# EasyEDA schematic SCH_T-Info Rail DIN_2022-03-13.json
TITLE: T-InfoDIN - Module Télé-Information en boitier DIN; REV: 1.4; Date: 2021-05-20; Sheet: 1/1; Drawn By: TrimVa; Company: Tech4You
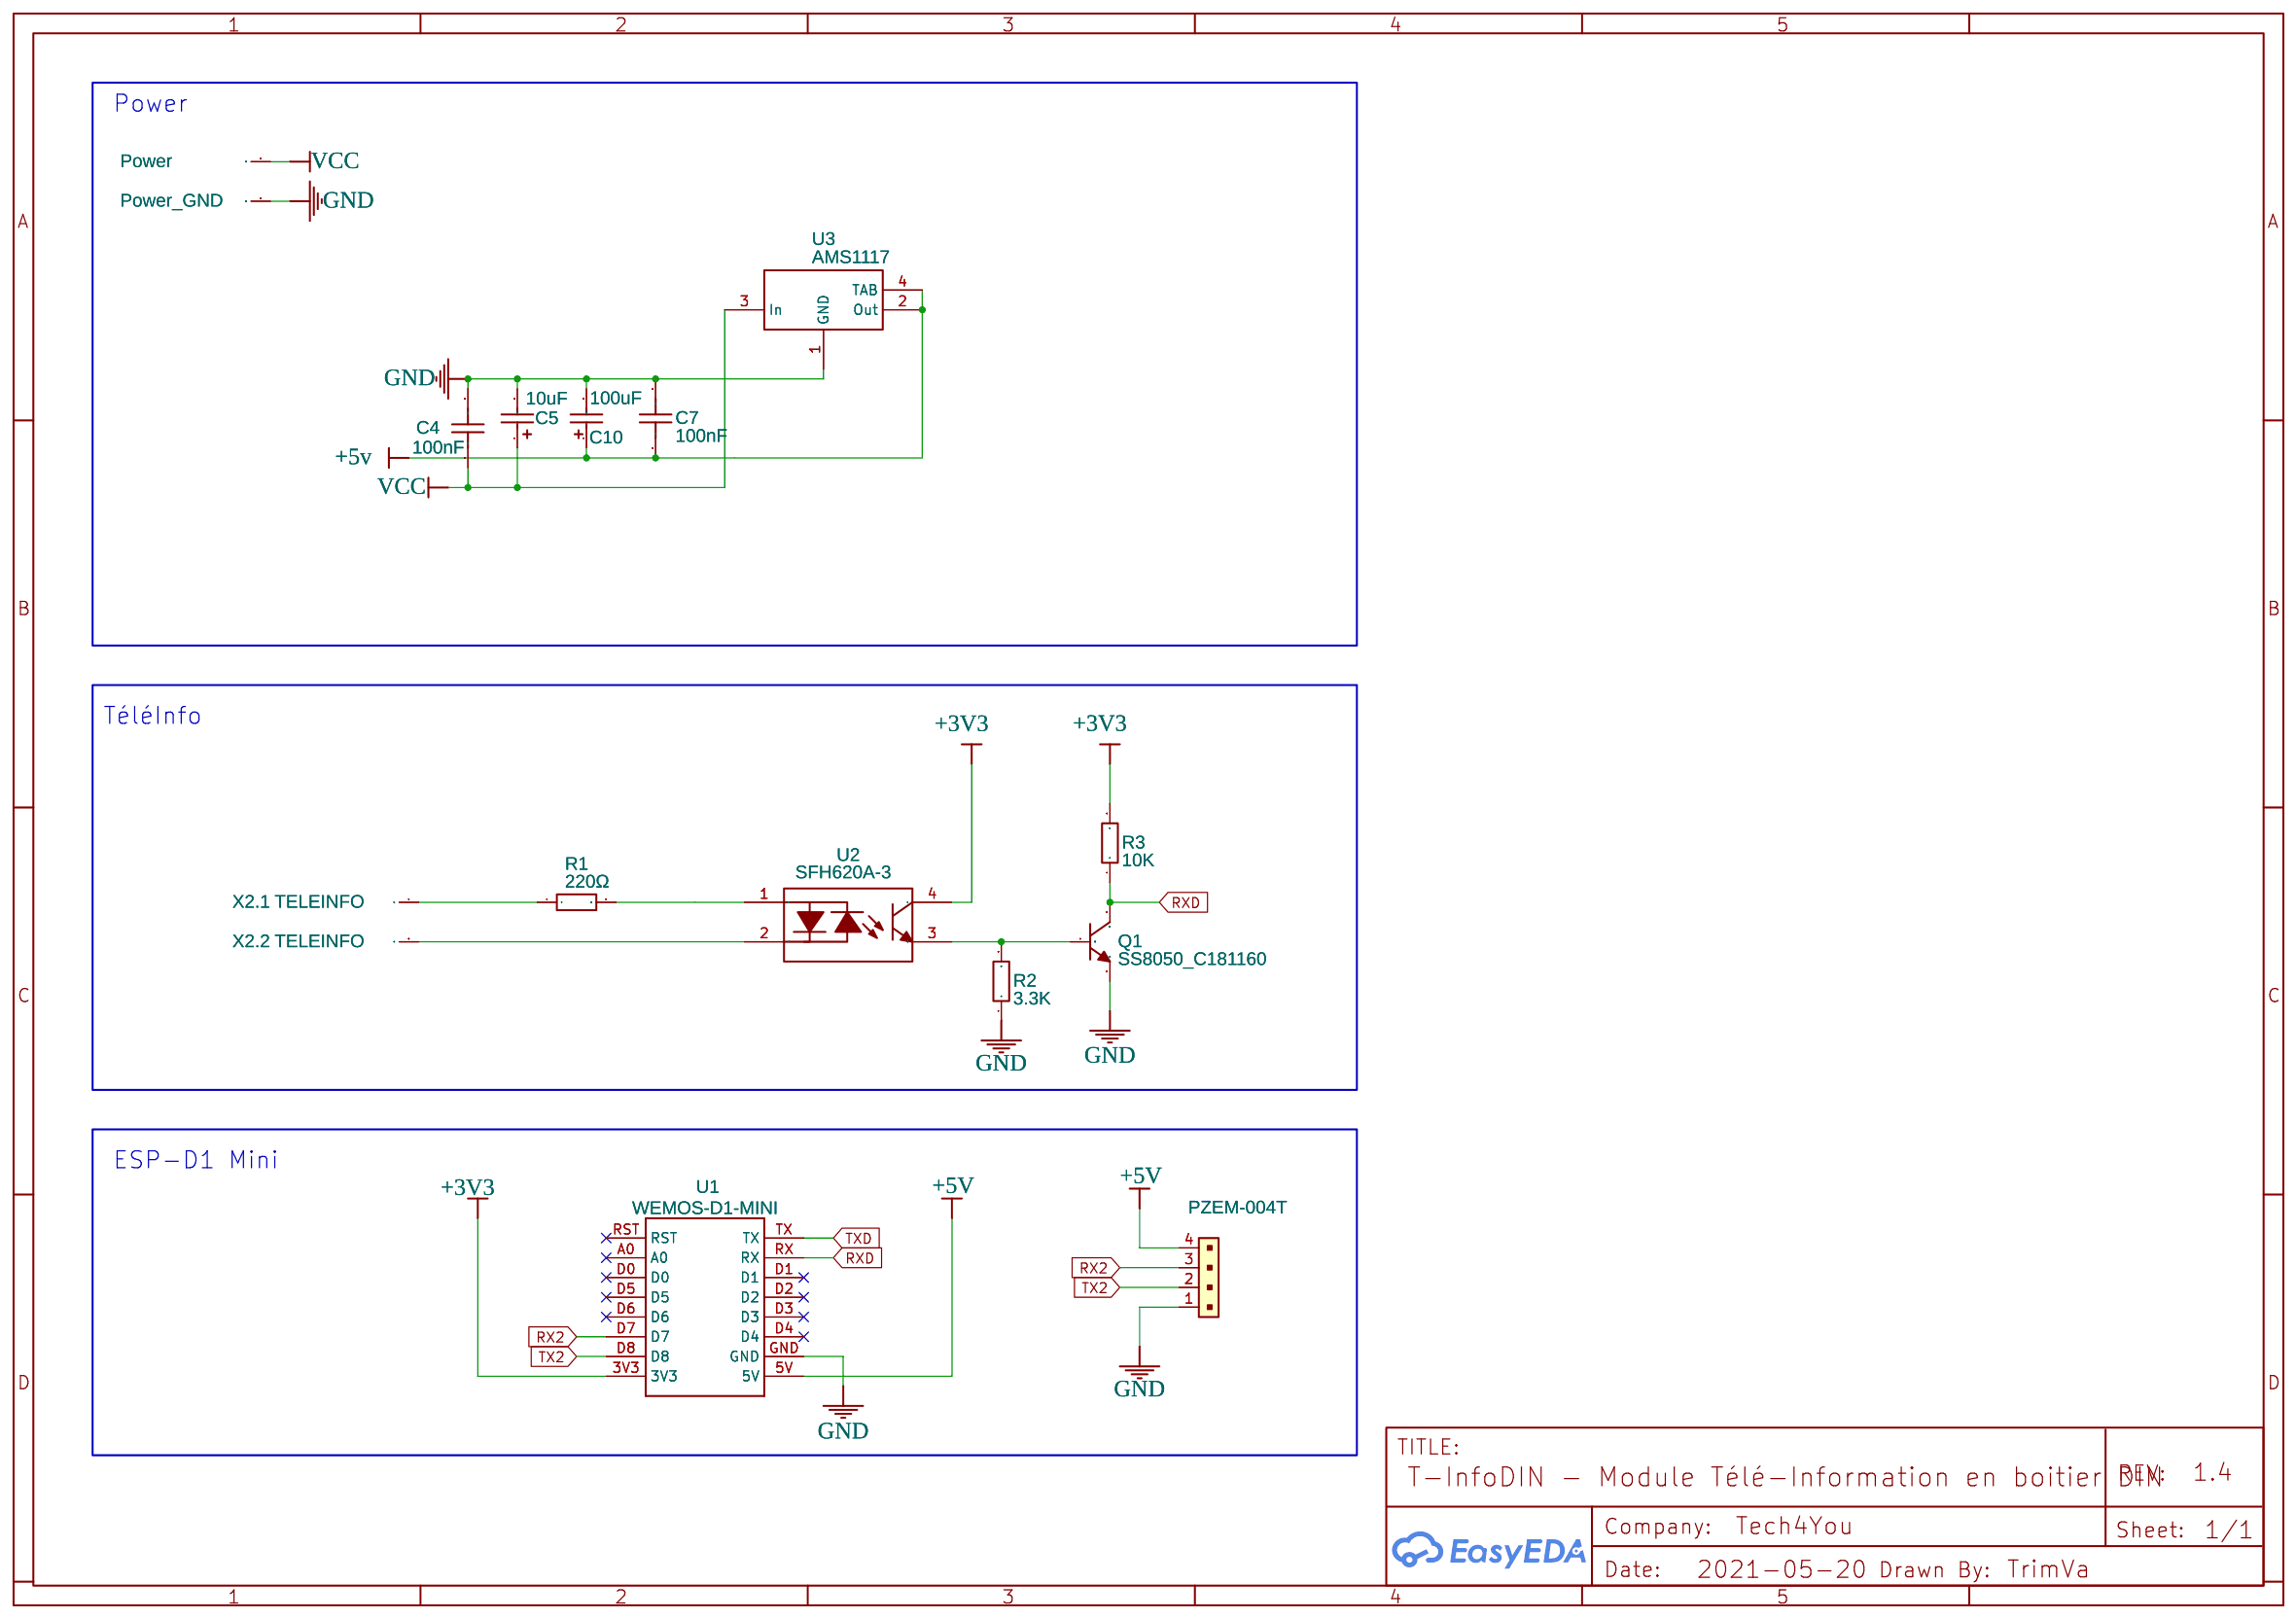
[diagram p0: schematic sheet]

## Parts
C4  100nF  [C0402]
C5  10uF  [CAP-SMD_L3.2-W1.6-R-RD]
C7  100nF  [C0402]
C10  100uF  [CAP-SMD_L3.2-W1.6-R-RD]
PZEM-004T  dk_Rectangular-Connectors-Headers-Male-Pins_0022232041  [PINHEADER_1X4_P2.54MM_DRILL1.02MM]
Q1  SS8050_C181160  [SOT-23-3_L2.9-W1.6-P1.90-LS2.8-BR]
R1  220Ω  [R0805]
R2  3.3K  [R0805]
R3  10K  [R0805]
U1  WEMOS-D1-MINI  [WEMOS-D1-MINI-V2.3.0-GMA]
U2  SFH620A-3  [DIP-4_L6.6-W4.7-P2.54-LS10.5-BL]
U3  AMS1117  [SOT-223_L6.5-W3.5-P2.30-LS7.0-BR]
X1  Power_GND  [W237-102]  (sections 1,2)
X2  TELEINFO  [W237-102]  (sections 1,2)

## Library data of the parts
C4 C7 = TCC0402X7R104K160AT: Supplier: LCSC; Supplier Part: C392963; Manufacturer: CCTC; Contributor: LCSC; JLCPCB Part Class: Extended Part
C5 = TAJA106K016RNJ: Supplier: LCSC; Manufacturer: AVX; Supplier Part: C7171; JLCPCB Part Class: Basic Part
C10 = T490A107M006ATE800: Supplier: LCSC; Manufacturer: KEMET; Supplier Part: C122251; JLCPCB Part Class: Extended Part
PZEM-004T = dk_Rectangular-Connectors-Headers-Male-Pins_0022232041: Manufacturer: Molex; Contributor: arif717
Q1 = SS8050_C181160: Supplier: LCSC; Manufacturer: Hottech; Manufacturer Part: SS8050; Contributor: LCSC; Supplier Part: C181160; JLCPCB Part Class: Extended Part
R1 = QR0805J220RP05: Supplier: LCSC; Supplier Part: C176207; Manufacturer: Ever Ohms Tech; Resistance (Ohms): 220; Contributor: LCSC; JLCPCB Part Class: Extended Part
R2 = RMC08053.3K1%N: Supplier: LCSC; Supplier Part: C269541; Manufacturer: Tyohm; Contributor: LCSC; JLCPCB Part Class: Extended Part
R3 = QR0805J10KP05: Supplier: LCSC; Manufacturer: EVER OHMS; Contributor: LCSC; Supplier Part: C149881; JLCPCB Part Class: Extended Part
U1 = WEMOS-D1-MINI-GMA: sourceId: YemgaslDx; Contributor: grichm
U2 = SFH620A-3: Supplier: LCSC; Supplier Part: C500642; Manufacturer: Vishay Intertech; Contributor: LCSC; JLCPCB Part Class: Extended Part
U3 = AMS1117-5.0: sourceId: HltLFyQwq; Supplier: LCSC; Manufacturer: AMS; Supplier Part: C6187; JLCPCB Part Class: Basic Part
X1 X2 = W237-102: Contributor: TrimVa; subpart_no: 1

## Nets
+3V3: R3.2 U1.3V3 U2.4
+5V: PZEM-004T.4 U1.5V
+5v: C7.1 C10.1 U3.2(Out) U3.4(TAB)
GND: C4.2 C5.2 C7.2 C10.2 PZEM-004T.1 Q1.2(E) R2.1 U1.GND U3.1(GND) X1.1(KL)
VCC: C4.1 C5.1 U3.3(In) X1.2(KL)
RX2: PZEM-004T.3 U1.D7
RXD: Q1.3(C) R3.1 U1.RX
TX2: PZEM-004T.2 U1.D8
TXD: U1.TX
Net-(Q1-1): Q1.1(B) R2.2 U2.3
Net-(R1-1): R1.1 X2.1(KL)
Net-(R1-2): R1.2 U2.1
Net-(U2-2): U2.2 X2.2(KL)

Not connected (* = marked no-connect by the designer): U1 A0* D0* D1* D2* D3* D4* D5* D6* RST*

## Notes on the sheet
- Power
- TéléInfo
- ESP-D1 Mini
